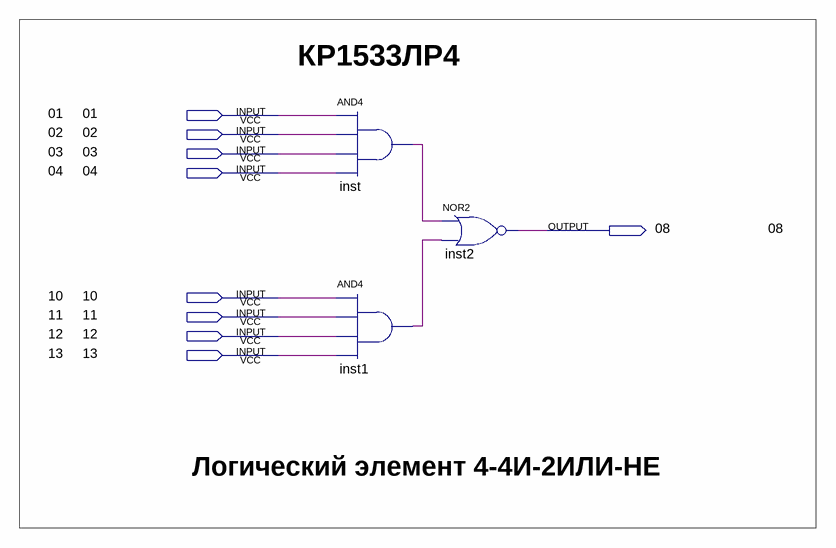
[diagram p0: schematic sheet]
// Quartus schematic KP1533LR4.bdf as structural Verilog: 3 symbols, 9 pins
module KP1533LR4 (
  input  \01 ,
  input  \02 ,
  input  \03 ,
  input  \04 ,
  input  \10 ,
  input  \11 ,
  input  \12 ,
  input  \13 ,
  output \08 
);

  wire inst1_out, inst_out;

  and inst (inst_out, \01 , \02 , \03 , \04 );
  and inst1 (inst1_out, \10 , \11 , \12 , \13 );
  nor inst2 (\08 , inst_out, inst1_out);

  // Notes on the sheet:
  //   КР1533ЛР4
  //   01
  //   02
  //   03
  //   04
  //   08
  //   10
  //   11
  //   12
  //   13
  //   Логический элемент 4-4И-2ИЛИ-НЕ
endmodule
